# EAGLE design 12V -5V ()v.2 (EAGLE 9.6.2)
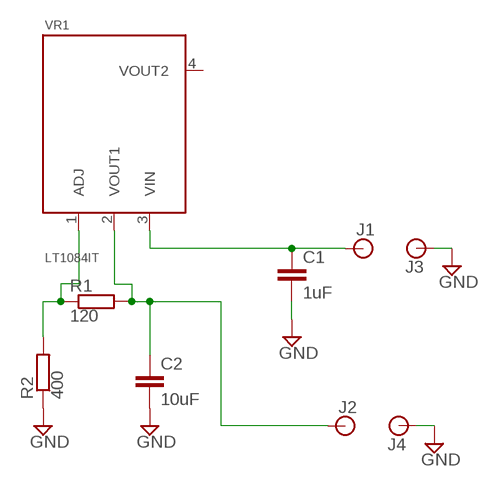
[diagram p0: schematic, sheet 1]

## Parts
C1  1uF  C-EUC0805  [C0805]
C2  10uF  C-EUC0805  [C0805]
J1  BANANA_CONN  [BANANA_CONN]
J2  BANANA_CONN  [BANANA_CONN]
J3  BANANA_CONN  [BANANA_CONN]
J4  BANANA_CONN  [BANANA_CONN]
R1  120  R-EU_R0805  [R0805]
R2  400  R-EU_R0805  [R0805]
VR1  LT1084IT  [LT1084IT]

## Nets
GND: C1.2 C2.2 J3.P$1 J4.P$1 R2.1
N$2: R1.1 R2.2 VR1.1(ADJ)
VIN: C1.1 J1.P$1 VR1.3(VIN)
VOUT: C2.1 J2.P$1 R1.2 VR1.2(VOUT1)
Unconnected: VR1.4(VOUT2)

## Library data of the parts
C1 C2 = rcl:C-EU: CAPACITOR, European symbol; SPICEPREFIX: C
J1-J4 = SparkFun-Connectors:BANANA_CONN: Through-hole Banana Jack Basic PTH connection for banana jack plugs SparkFun Products: Multimeter Kit <https://www.sparkfun.com/products/retired/10956> Banana to Alligator Cable <https://www.sparkfun.com/products/retired/509> Banana to Alligator Coax Cable <https://www.sparkfun.com/products/retired/508> Banana to Banana Cable <https://www.sparkfun.com/products/retired/507> Banana to IC Hook Cables <https://www.sparkfun.com/products/retired/506>
R1 R2 = rcl:R-EU_: RESISTOR, European symbol; SPICEPREFIX: R
VR1 = LT1084IT:LT1084IT: Check prices <https://snapeda.com/parts/LT1084IT/Linear%20Technology/view-part/?ref=eda>; ARROW_ELECTRONICS-PURCHASE-URL: https://snapeda.com/shop?store=Arrow+Electronics&id=582278; AVAILABILITY: Warning; DESCRIPTION: Linear Voltage Regulator IC 1 Output 5A TO-220-3; MF: Linear Technology; MP: LT1084IT; PACKAGE: TO-220 Linear Technology; PRICE: None

## Board
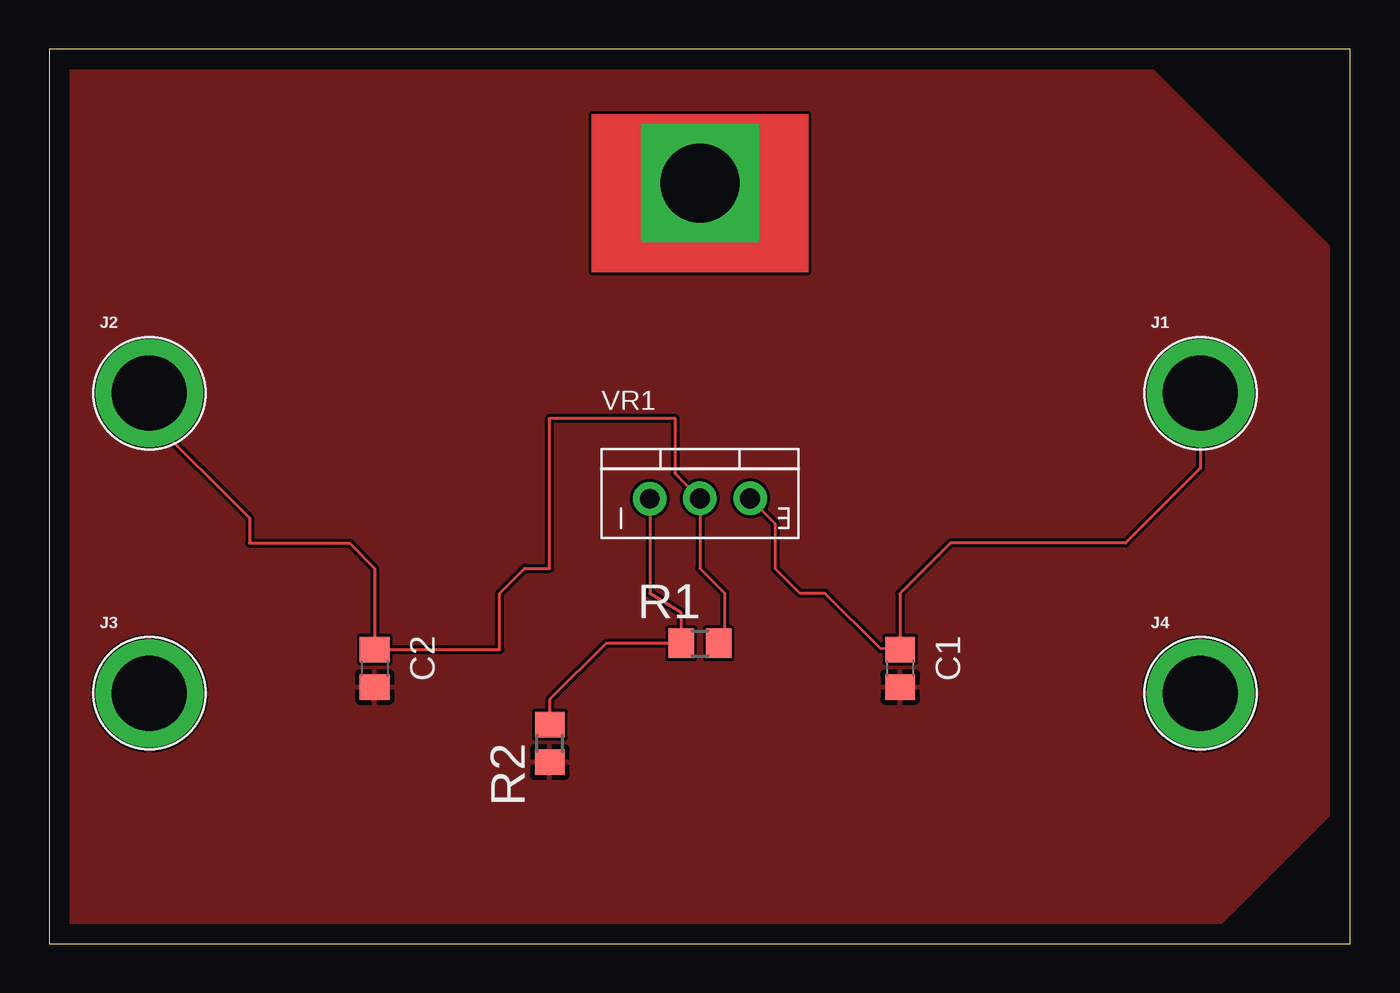
[diagram p1: board, top side]

Size 66.02 x 45.39 mm. Coordinates in mm from the lower left corner, seen from the top.
Outline: 0,0 66.02,0 66.02,45.39 0,45.39 0,0
Copper layers (1*16): Top 0.035mm / dielectric 1.5mm / Bottom 0.035mm
Design rules "default": minimum track width 6mil, minimum drill 0.35mm, track to track 6mil, track to pad 6mil, pad to pad 6mil, via to via 6mil, smd to smd 6mil, copper to edge 40mil, drill to drill 6mil, minimum pad ring 10mil, minimum via ring 8mil, stop-mask expansion 4mil, vias tented up to drill 0mil, thermal gap 10mil

### Footprints (pad centres in the part's own frame; a part is rotated, then mirrored left to right if it is on the bottom)
C0805 = smd 1.3 x 1.5: 1 -0.95,0; 2 0.95,0
BANANA_CONN = drill 3.81 pad 5.461: P$1 0,0
R0805 = smd 1.3 x 1.5: 1 -0.95,0; 2 0.95,0
LT1084IT = drill 1 pad 1.7: 1 -2.54,0.988; 2 0,1; 3 2.54,1 | drill 4 pad 6 square: 4 0,17

### Placement (x,y rotation side)
C1  43.18,13.97 270 top
C2  16.51,13.97 270 top
J1  58.42,27.94 0 top
J2  5.08,27.94 0 top
J3  5.08,12.7 0 top
J4  58.42,12.7 0 top
R1  33.02,15.24 0 top
R2  25.4,10.16 90 top
VR1  33.02,21.59 0 top

### Tracks (layer width: path | path; a pad name or v marks a point on that pad's centre or on a via)
GND
  pour Top (isolate 0.025): 0,44.45 0,0 58.42,0 66.04,7.62 66.04,34.29 55.88,44.45
N$2
  Top 0.152: VR1.1 30.48,17.78 32.07,16.8 R1.1 28.26,15.24 25.4,12.38 R2.2
VIN
  Top 0.152: VR1.3 36.83,21.32 36.83,19.05 38.1,17.78 39.37,17.78 42.18,14.97 43.16,14.92 | C1.1 43.16,14.92 | J1.P$1 58.42,24.13 54.61,20.32 45.72,20.32 43.16,17.76 43.16,14.92
VOUT
  Top 0.152: R1.2 34.29,15.38 34.29,17.78 33.02,19.05 VR1.2 31.75,23.86 31.75,26.67 25.4,26.67 25.4,19.05 24.13,19.05 22.86,17.78 22.86,14.92 C2.1 16.51,19.05 15.24,20.32 10.16,20.32 10.16,21.59 5.08,26.67 J2.P$1